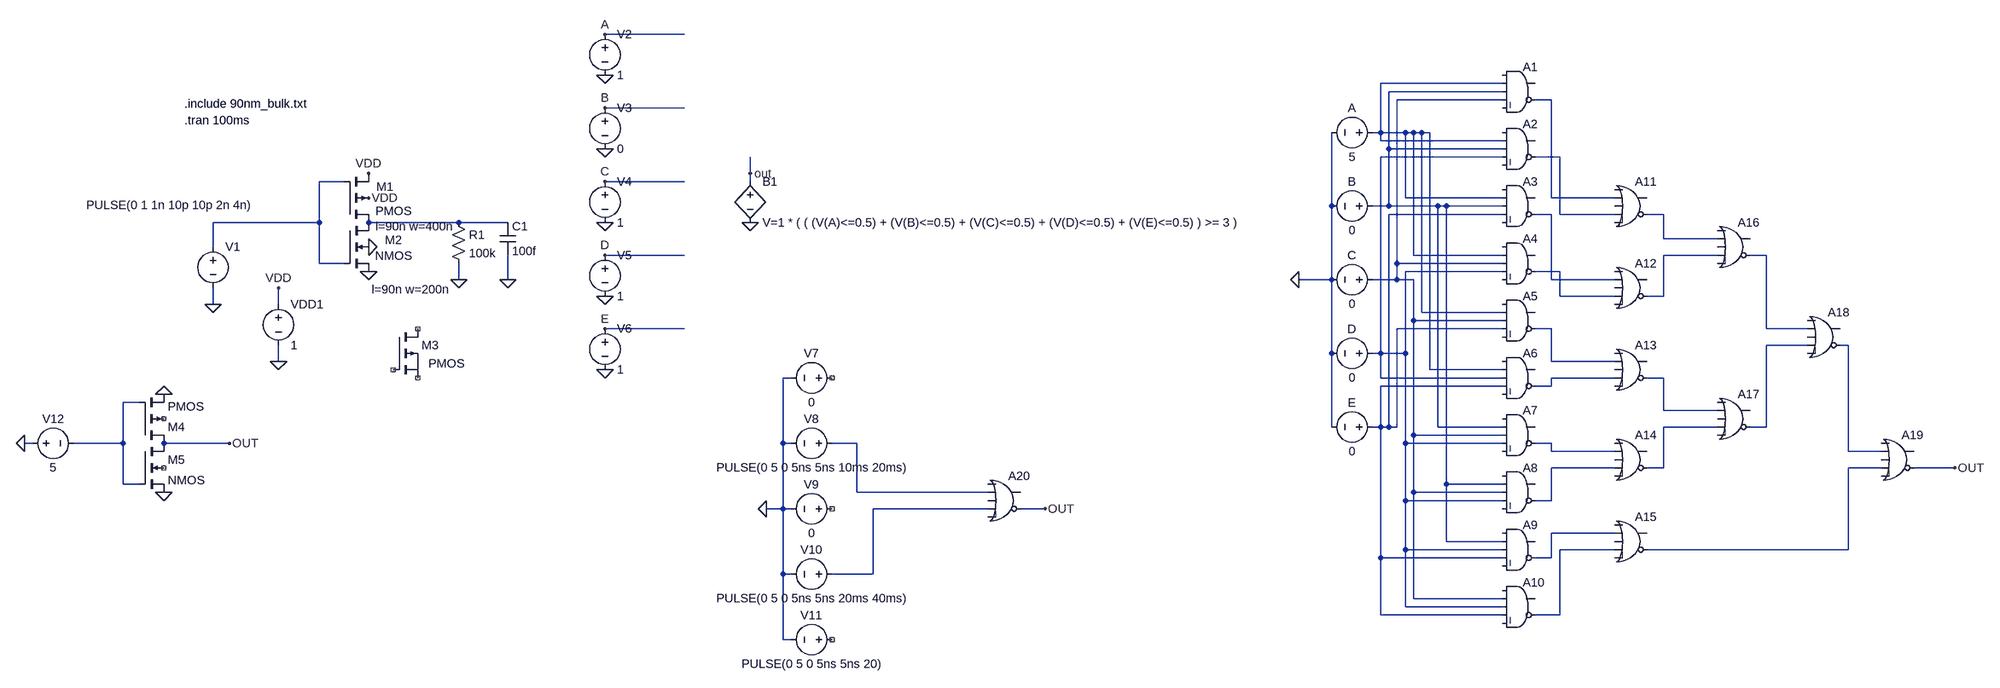
[diagram p0: schematic Draft2.asc]
Draft2.asc, the LTspice schematic file:
Version 4
SHEET 1 4484 1248
WIRE 1280 0 1056 0
WIRE 3424 96 2928 96
WIRE 3424 112 2944 112
WIRE 3424 128 2960 128
WIRE 3520 128 3488 128
WIRE 1280 144 1056 144
WIRE 2928 192 2928 96
WIRE 2928 192 2912 192
WIRE 2976 192 2928 192
WIRE 2992 192 2976 192
WIRE 3008 192 2992 192
WIRE 3024 192 3008 192
WIRE 2928 208 2928 192
WIRE 3424 208 2928 208
WIRE 2944 224 2944 112
WIRE 3424 224 2944 224
WIRE 3424 240 2928 240
WIRE 3536 240 3488 240
WIRE 1408 272 1408 240
WIRE 368 288 320 288
WIRE 1280 288 1056 288
WIRE 1408 288 1408 272
WIRE 2976 320 2976 192
WIRE 3424 320 2976 320
WIRE 3520 320 3520 128
WIRE 3696 320 3520 320
WIRE 2832 336 2832 192
WIRE 2944 336 2944 224
WIRE 2944 336 2912 336
WIRE 3040 336 2944 336
WIRE 3056 336 3040 336
WIRE 3424 336 3056 336
WIRE 3424 352 2944 352
WIRE 3520 352 3488 352
WIRE 3536 352 3536 240
WIRE 3696 352 3536 352
WIRE 3792 352 3760 352
WIRE 320 368 320 288
WIRE 320 368 112 368
WIRE 592 368 416 368
WIRE 688 368 592 368
WIRE 3792 400 3792 352
WIRE 3952 400 3792 400
WIRE 112 416 112 368
WIRE 1280 432 1056 432
WIRE 2992 432 2992 192
WIRE 3424 432 2992 432
WIRE 3952 432 3792 432
WIRE 4048 432 4016 432
WIRE 320 448 320 368
WIRE 368 448 320 448
WIRE 2960 448 2960 128
WIRE 3424 448 2960 448
WIRE 3424 464 2976 464
WIRE 3536 464 3488 464
WIRE 592 480 592 448
WIRE 688 480 688 432
WIRE 2832 480 2832 336
WIRE 2832 480 2768 480
WIRE 2960 480 2960 448
WIRE 2960 480 2912 480
WIRE 2992 480 2960 480
WIRE 3520 480 3520 352
WIRE 3696 480 3520 480
WIRE 3536 512 3536 464
WIRE 3696 512 3536 512
WIRE 3792 512 3792 432
WIRE 3792 512 3760 512
WIRE 112 528 112 496
WIRE 240 528 240 496
WIRE 3008 544 3008 192
WIRE 3424 544 3008 544
WIRE 2992 560 2992 480
WIRE 3424 560 2992 560
WIRE 1280 576 1056 576
WIRE 3424 576 2960 576
WIRE 3520 576 3488 576
WIRE 4048 576 4048 432
WIRE 4128 576 4048 576
WIRE 4128 608 4048 608
WIRE 4208 608 4192 608
WIRE 2832 624 2832 480
WIRE 2928 624 2928 240
WIRE 2928 624 2912 624
WIRE 2976 624 2976 464
WIRE 2976 624 2928 624
WIRE 240 640 240 608
WIRE 3520 640 3520 576
WIRE 3696 640 3520 640
WIRE 3024 656 3024 192
WIRE 3424 656 3024 656
WIRE 1488 672 1472 672
WIRE 2928 672 2928 624
WIRE 3424 672 2928 672
WIRE 3696 672 3520 672
WIRE 3792 672 3760 672
WIRE 3424 688 2928 688
WIRE 3520 688 3520 672
WIRE 3520 688 3488 688
WIRE -32 720 -64 720
WIRE 3792 736 3792 672
WIRE 3952 736 3792 736
WIRE 2832 768 2832 624
WIRE 2928 768 2928 688
WIRE 2928 768 2912 768
WIRE 2944 768 2944 352
WIRE 2944 768 2928 768
WIRE 2960 768 2960 576
WIRE 2960 768 2944 768
WIRE 3040 768 3040 336
WIRE 3424 768 3040 768
WIRE 3952 768 3792 768
WIRE 4048 768 4048 608
WIRE 4048 768 4016 768
WIRE 2992 784 2992 560
WIRE 3424 784 2992 784
WIRE -240 800 -256 800
WIRE -64 800 -64 720
WIRE -64 800 -160 800
WIRE 144 800 16 800
WIRE 1472 800 1472 672
WIRE 1488 800 1472 800
WIRE 1616 800 1568 800
WIRE 2976 800 2976 624
WIRE 3424 800 2976 800
WIRE 3520 800 3488 800
WIRE 3520 816 3520 800
WIRE 3696 816 3520 816
WIRE 4208 816 4208 608
WIRE 4272 816 4208 816
WIRE 3696 848 3520 848
WIRE 3792 848 3792 768
WIRE 3792 848 3760 848
WIRE 4272 848 4208 848
WIRE 4416 848 4336 848
WIRE -64 880 -64 800
WIRE -32 880 -64 880
WIRE 3056 880 3056 336
WIRE 3424 880 3056 880
WIRE 1616 896 1616 800
WIRE 1872 896 1616 896
WIRE 2992 896 2992 784
WIRE 3424 896 2992 896
WIRE 2976 912 2976 800
WIRE 3424 912 2976 912
WIRE 3520 912 3520 848
WIRE 3520 912 3488 912
WIRE 1472 928 1472 800
WIRE 1472 928 1440 928
WIRE 1488 928 1472 928
WIRE 1872 928 1648 928
WIRE 1984 928 1936 928
WIRE 3696 976 3520 976
WIRE 3056 992 3056 880
WIRE 3424 992 3056 992
WIRE 2976 1008 2976 912
WIRE 3424 1008 2976 1008
WIRE 3696 1008 3536 1008
WIRE 4208 1008 4208 848
WIRE 4208 1008 3760 1008
WIRE 2928 1024 2928 768
WIRE 3424 1024 2928 1024
WIRE 3520 1024 3520 976
WIRE 3520 1024 3488 1024
WIRE 1472 1056 1472 928
WIRE 1488 1056 1472 1056
WIRE 1648 1056 1648 928
WIRE 1648 1056 1568 1056
WIRE 2992 1104 2992 896
WIRE 3424 1104 2992 1104
WIRE 2976 1120 2976 1008
WIRE 3424 1120 2976 1120
WIRE 2928 1136 2928 1024
WIRE 3424 1136 2928 1136
WIRE 3536 1136 3536 1008
WIRE 3536 1136 3488 1136
WIRE 1472 1184 1472 1056
WIRE 1488 1184 1472 1184
FLAG 416 464 0
FLAG 416 416 0
FLAG 592 480 0
FLAG 688 480 0
FLAG 416 272 VDD
FLAG 240 496 VDD
FLAG 416 320 VDD
FLAG 112 528 0
FLAG 240 640 0
FLAG 1056 80 0
FLAG 1056 224 0
FLAG 1056 368 0
FLAG 1056 512 0
FLAG 1056 656 0
FLAG 1408 368 0
FLAG 1056 0 A
FLAG 1056 144 B
FLAG 1056 288 C
FLAG 1056 432 D
FLAG 1056 576 E
FLAG 1408 272 out
FLAG 2768 480 0
FLAG 4416 848 OUT
FLAG 1984 928 OUT
FLAG 1440 928 0
FLAG 16 896 0
FLAG 16 704 0
FLAG -256 800 0
FLAG 144 800 OUT
SYMBOL pmos4 368 368 M180
WINDOW 3 62 22 Left 2
WINDOW 123 62 -8 Left 2
WINDOW 0 63 70 Left 2
SYMATTR Value2 l=90n w=400n
SYMATTR InstName M1
SYMBOL nmos4 368 368 R0
WINDOW 123 54 131 Left 2
WINDOW 0 80 34 Left 2
WINDOW 3 61 65 Left 2
SYMATTR Value2 l=90n w=200n
SYMATTR InstName M2
SYMBOL voltage 112 400 R0
WINDOW 3 -247 -66 Left 2
WINDOW 123 0 0 Left 0
WINDOW 39 24 124 Left 2
SYMATTR Value PULSE(0 1 1n 10p 10p 2n 4n)
SYMATTR InstName V1
SYMBOL voltage 240 512 R0
WINDOW 123 0 0 Left 0
WINDOW 39 0 0 Left 0
SYMATTR InstName VDD1
SYMATTR Value 1
SYMBOL res 576 352 R0
SYMATTR InstName R1
SYMATTR Value 100k
SYMBOL cap 672 368 R0
SYMATTR InstName C1
SYMATTR Value 100f
SYMBOL voltage 1056 -16 R0
WINDOW 123 0 0 Left 0
WINDOW 39 0 0 Left 0
SYMATTR InstName V2
SYMATTR Value 1
SYMBOL voltage 1056 128 R0
WINDOW 123 0 0 Left 0
WINDOW 39 0 0 Left 0
SYMATTR InstName V3
SYMATTR Value 0
SYMBOL voltage 1056 272 R0
WINDOW 123 0 0 Left 0
WINDOW 39 0 0 Left 0
SYMATTR InstName V4
SYMATTR Value 1
SYMBOL voltage 1056 416 R0
WINDOW 123 0 0 Left 0
WINDOW 39 0 0 Left 0
SYMATTR InstName V5
SYMATTR Value 1
SYMBOL voltage 1056 560 R0
WINDOW 123 0 0 Left 0
WINDOW 39 0 0 Left 0
SYMATTR InstName V6
SYMATTR Value 1
SYMBOL bv 1408 272 R0
SYMATTR InstName B1
SYMATTR Value V=1 * ( ( (V(A)<=0.5) + (V(B)<=0.5) + (V(C)<=0.5) + (V(D)<=0.5) + (V(E)<=0.5) ) >= 3 )
SYMBOL Digital\\and 3456 48 R0
SYMATTR InstName A1
SYMBOL Digital\\and 3456 160 R0
SYMATTR InstName A2
SYMBOL Digital\\and 3456 272 R0
SYMATTR InstName A3
SYMBOL Digital\\and 3456 384 R0
SYMATTR InstName A4
SYMBOL Digital\\and 3456 496 R0
SYMATTR InstName A5
SYMBOL Digital\\and 3456 608 R0
SYMATTR InstName A6
SYMBOL Digital\\and 3456 720 R0
SYMATTR InstName A7
SYMBOL Digital\\and 3456 832 R0
SYMATTR InstName A8
SYMBOL Digital\\and 3456 944 R0
SYMATTR InstName A9
SYMBOL Digital\\and 3456 1056 R0
SYMATTR InstName A10
SYMBOL voltage 2928 192 R90
WINDOW 0 -32 56 VBottom 2
WINDOW 3 32 56 VTop 2
WINDOW 123 0 0 Left 0
WINDOW 39 0 0 Left 0
SYMATTR InstName A
SYMATTR Value 5
SYMBOL voltage 2928 336 R90
WINDOW 0 -32 56 VBottom 2
WINDOW 3 32 56 VTop 2
WINDOW 123 0 0 Left 0
WINDOW 39 0 0 Left 0
SYMATTR InstName B
SYMATTR Value 0
SYMBOL voltage 2928 480 R90
WINDOW 0 -32 56 VBottom 2
WINDOW 3 32 56 VTop 2
WINDOW 123 0 0 Left 0
WINDOW 39 0 0 Left 0
SYMATTR InstName C
SYMATTR Value 0
SYMBOL voltage 2928 624 R90
WINDOW 0 -32 56 VBottom 2
WINDOW 3 32 56 VTop 2
WINDOW 123 0 0 Left 0
WINDOW 39 0 0 Left 0
SYMATTR InstName D
SYMATTR Value 0
SYMBOL voltage 2928 768 R90
WINDOW 0 -32 56 VBottom 2
WINDOW 3 32 56 VTop 2
WINDOW 123 0 0 Left 0
WINDOW 39 0 0 Left 0
SYMATTR InstName E
SYMATTR Value 0
SYMBOL Digital\\or 3728 272 R0
SYMATTR InstName A11
SYMBOL Digital\\or 3728 432 R0
SYMATTR InstName A12
SYMBOL Digital\\or 3728 592 R0
SYMATTR InstName A13
SYMBOL Digital\\or 3728 768 R0
SYMATTR InstName A14
SYMBOL Digital\\or 3728 928 R0
SYMATTR InstName A15
SYMBOL Digital\\or 3984 352 R0
SYMATTR InstName A16
SYMBOL Digital\\or 3984 688 R0
SYMATTR InstName A17
SYMBOL Digital\\or 4160 528 R0
SYMATTR InstName A18
SYMBOL Digital\\or 4304 768 R0
SYMATTR InstName A19
SYMBOL voltage 1584 672 R90
WINDOW 0 -32 56 VBottom 2
WINDOW 3 32 56 VTop 2
WINDOW 123 0 0 Left 0
WINDOW 39 0 0 Left 0
SYMATTR InstName V7
SYMATTR Value 0
SYMBOL voltage 1584 800 R90
WINDOW 0 -32 56 VBottom 2
WINDOW 3 32 56 VTop 2
WINDOW 123 0 0 Left 0
WINDOW 39 0 0 Left 0
SYMATTR InstName V8
SYMATTR Value PULSE(0 5 0 5ns 5ns 10ms 20ms)
SYMBOL voltage 1584 928 R90
WINDOW 0 -32 56 VBottom 2
WINDOW 3 32 56 VTop 2
WINDOW 123 0 0 Left 0
WINDOW 39 0 0 Left 0
SYMATTR InstName V9
SYMATTR Value 0
SYMBOL voltage 1584 1056 R90
WINDOW 0 -32 56 VBottom 2
WINDOW 3 32 56 VTop 2
WINDOW 123 0 0 Left 0
WINDOW 39 0 0 Left 0
SYMATTR InstName V10
SYMATTR Value PULSE(0 5 0 5ns 5ns 20ms 40ms)
SYMBOL voltage 1584 1184 R90
WINDOW 0 -32 56 VBottom 2
WINDOW 3 32 56 VTop 2
WINDOW 123 0 0 Left 0
WINDOW 39 0 0 Left 0
SYMATTR InstName V11
SYMATTR Value PULSE(0 5 0 5ns 5ns 20)
SYMBOL Digital\\or 1904 848 R0
SYMATTR InstName A20
SYMBOL pmos 464 576 R0
WINDOW 3 69 68 Left 2
SYMATTR InstName M3
SYMBOL pmos4 -32 800 M180
SYMATTR InstName M4
SYMBOL nmos4 -32 800 R0
SYMATTR InstName M5
SYMBOL voltage -256 800 M90
WINDOW 0 -32 56 VBottom 2
WINDOW 3 32 56 VTop 2
WINDOW 123 0 0 Left 0
WINDOW 39 0 0 Left 0
SYMATTR InstName V12
SYMATTR Value 5
TEXT 56 136 Left 2 !.include 90nm_bulk.txt
TEXT 56 168 Left 2 !.tran 100ms

The netlist it stands for:
* Draft2.asc
M1 N011 N007 VDD VDD PMOS l=90n w=400n
M2 N011 N007 0 0 NMOS l=90n w=200n
V1 N007 0 PULSE(0 1 1n 10p 10p 2n 4n)
VDD1 VDD 0 1
R1 N011 0 100k
C1 N011 0 100f
V2 A 0 1
V3 B 0 0
V4 C 0 1
V5 D 0 1
V6 E 0 1
B1 out 0 V=1 * ( ( (V(A)<=0.5) + (V(B)<=0.5) + (V(C)<=0.5) + (V(D)<=0.5) + (V(E)<=0.5) ) >= 3 )
A1 0 N001 N002 N003 0 N004 0 0 AND
A2 0 N001 N002 N005 0 N006 0 0 AND
A3 0 N001 N002 N008 0 N009 0 0 AND
A4 0 N001 N003 N005 0 N014 0 0 AND
A5 0 N001 N003 N008 0 N015 0 0 AND
A6 0 N001 N005 N008 0 N018 0 0 AND
A7 0 N002 N003 N005 0 N023 0 0 AND
A8 0 N002 N003 N005 0 N024 0 0 AND
A9 0 N002 N005 N008 0 N027 0 0 AND
A10 0 N003 N005 N008 0 N028 0 0 AND
V§A N001 0 5
V§B N002 0 0
V§C N003 0 0
V§D N005 0 0
V§E N008 0 0
A11 0 N004 0 N006 0 N010 0 0 OR
A12 0 N009 0 N014 0 N012 0 0 OR
A13 0 N015 0 N018 0 N019 0 0 OR
A14 0 N023 0 N024 0 N021 0 0 OR
A15 0 N027 0 N028 0 N025 0 0 OR
A16 0 N010 0 N012 0 N013 0 0 OR
A17 0 N019 0 N021 0 N016 0 0 OR
A18 0 N013 0 N016 0 N017 0 0 OR
A19 0 N017 0 N025 0 out 0 0 OR
V7 NC_01 0 0
V8 N022 0 PULSE(0 5 0 5ns 5ns 10ms 20ms)
V9 NC_02 0 0
V10 N026 0 PULSE(0 5 0 5ns 5ns 20ms 40ms)
V11 NC_03 0 PULSE(0 5 0 5ns 5ns 20)
A20 0 N022 0 N026 0 out 0 0 OR
M3 NC_04 NC_05 NC_06 NC_06 PMOS
M4 out N020 0 NC_07 PMOS
M5 out N020 0 NC_08 NMOS
V12 0 N020 5
.model NMOS NMOS
.model PMOS PMOS
.lib standard.mos
.include 90nm_bulk.txt
.tran 100ms
.backanno
.end